# EAGLE design PulseFit (EAGLE 7.3.0)
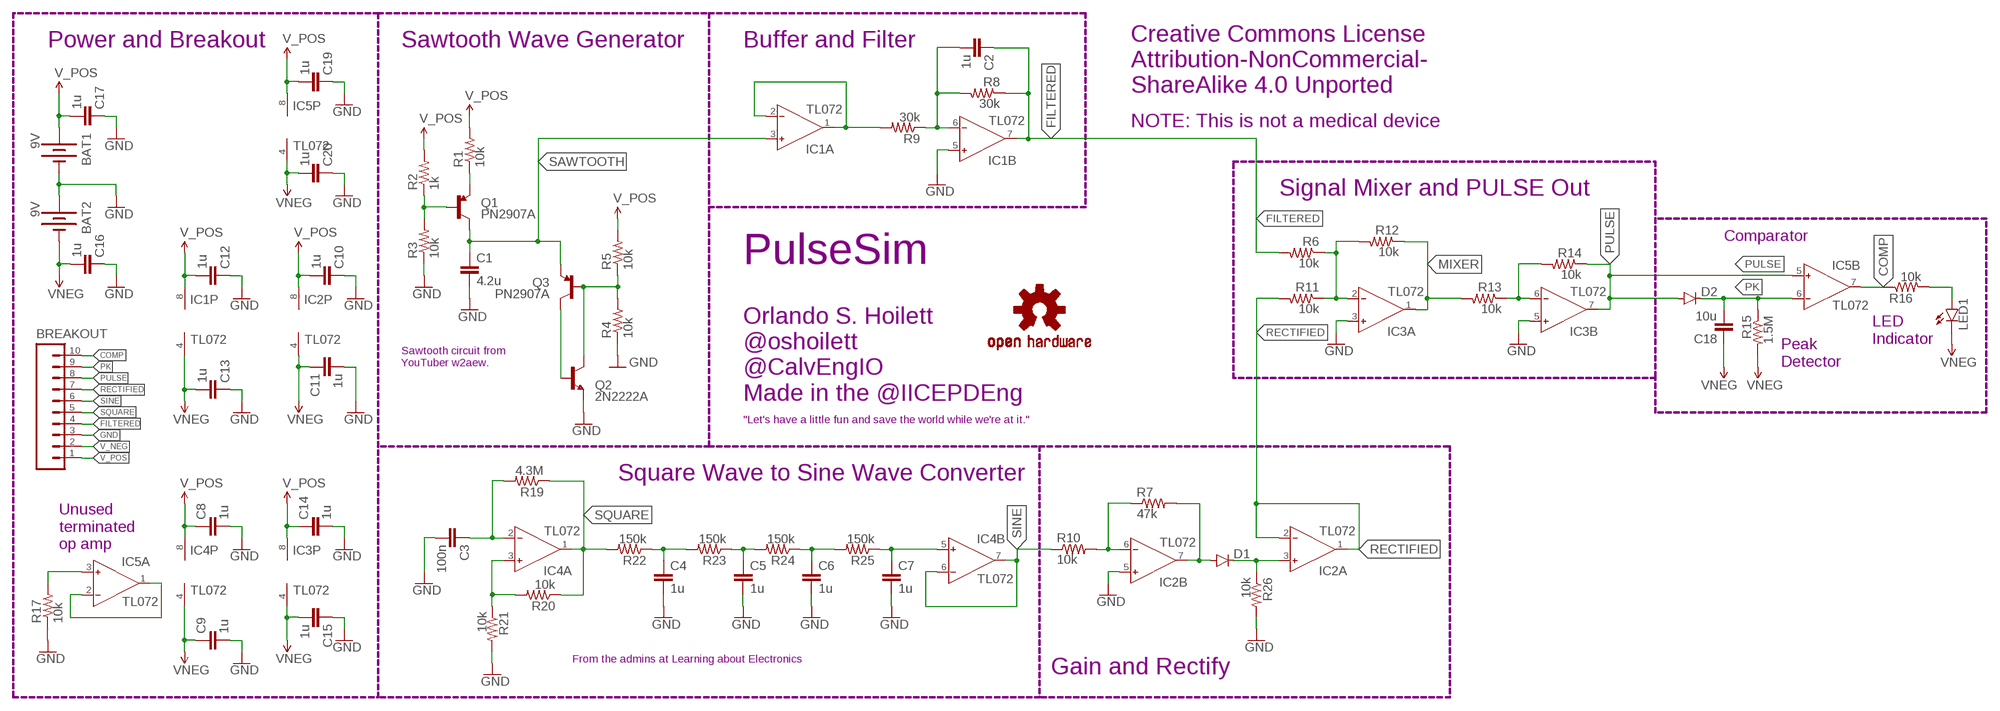
[diagram p0: schematic, sheet 1]

## Parts
BAT1  9V  BATTERY9V  [BATTCON_9V]
BAT2  9V  BATTERY9V  [BATTCON_9V]
BREAKOUT  M10NO_SILK_PTH_FEMALE  [1X10_NO_SILK]
C1  4.2u  C-EUC0402  [C0402]
C2  1u  C-EUC0402  [C0402]
C3  100n  C-EUC0402  [C0402]
C4  1u  C-EUC0402  [C0402]
C5  1u  C-EUC0402  [C0402]
C6  1u  C-EUC0402  [C0402]
C7  1u  C-EUC0402  [C0402]
C8  1u  C-EUC0402  [C0402]
C9  1u  C-EUC0402  [C0402]
C10  1u  C-EUC0402  [C0402]
C11  1u  C-EUC0402  [C0402]
C12  1u  C-EUC0402  [C0402]
C13  1u  C-EUC0402  [C0402]
C14  1u  C-EUC0402  [C0402]
C15  1u  C-EUC0402  [C0402]
C16  1u  C-EUC0402  [C0402]
C17  1u  C-EUC0402  [C0402]
C18  10u  C-EUC0402  [C0402]
C19  1u  C-EUC0402  [C0402]
C20  1u  C-EUC0402  [C0402]
D1  250mA/100V  DIODEBAS16  [SOD-323]
D2  250mA/100V  DIODEBAS16  [SOD-323]
IC1  TL072  AD8607R  [SO8]
IC2  TL072  AD8607R  [SO8]
IC3  TL072  AD8607R  [SO8]
IC4  TL072  AD8607R  [SO8]
IC5  TL072  AD8607R  [SO8]
LED1  LED1206-BOTTOM  [LED-1206-BOTTOM]
LOGO1  OSHW-LOGOS  [OSHW-LOGO-S]
Q1  PN2907A  TRANSISTOR_PNPMMBT4403  [SOT23-3]
Q2  2N2222A  TRANSISTOR_NPNMMBT5088  [SOT23-3]
Q3  PN2907A  TRANSISTOR_PNPMMBT4403  [SOT23-3]
R1  10k  R-US_R0402  [R0402]
R2  1k  R-US_R0402  [R0402]
R3  10k  R-US_R0402  [R0402]
R4  10k  R-US_R0402  [R0402]
R5  10k  R-US_R0402  [R0402]
R6  10k  R-US_R0402  [R0402]
R7  47k  R-US_R0402  [R0402]
R8  30k  R-US_R0402  [R0402]
R9  30k  R-US_R0402  [R0402]
R10  10k  R-US_R0402  [R0402]
R11  10k  R-US_R0402  [R0402]
R12  10k  R-US_R0402  [R0402]
R13  10k  R-US_R0402  [R0402]
R14  10k  R-US_R0402  [R0402]
R15  1.5M  R-US_R0402  [R0402]
R16  10k  R-US_R0402  [R0402]
R17  10k  R-US_R0402  [R0402]
R19  4.3M  R-US_R0402  [R0402]
R20  10k  R-US_R0402  [R0402]
R21  10k  R-US_R0402  [R0402]
R22  150k  R-US_R0402  [R0402]
R23  150k  R-US_R0402  [R0402]
R24  150k  R-US_R0402  [R0402]
R25  150k  R-US_R0402  [R0402]
R26  10k  R-US_R0402  [R0402]

## Nets
COMP: BREAKOUT.10 IC5.7(B:OUT) R16.1
FILTERED: BREAKOUT.4 C2.1 IC1.7(B:OUT) R6.2 R8.1
GND: BAT1.- BAT2.+ BREAKOUT.3 C1.2 C3.2 C4.2 C5.2 C6.2 C7.2 C8.2 C9.2 C10.1 C11.2 C12.1 C13.1 C14.2 C15.1 C16.1 C17.1 C19.1 C20.1 IC1.5(B:IN+) IC2.5(B:IN+) IC3.3(A:IN+) IC3.5(B:IN+) Q2.2(E) R3.1 R4.1 R17.1 R21.2 R26.2
MIXER: IC3.1(A:OUT) R12.1 R13.2
N$1: Q1.2(E) R1.1
N$2: IC3.6(B:IN-) R13.1 R14.2
N$3: Q1.1(B) R2.1 R3.2
N$4: Q2.3(C) Q3.1(B) R4.2 R5.1
N$5: Q2.1(B) Q3.3(C)
N$6: IC1.1(A:OUT) IC1.2(A:IN-) R9.2
N$8: IC3.2(A:IN-) R6.1 R11.1 R12.2
N$10: LED1.A R16.2
N$11: C2.2 IC1.6(B:IN-) R8.2 R9.1
N$12: IC5.1(A:OUT) IC5.2(A:IN-)
N$13: IC5.3(A:IN+) R17.2
N$17: C3.1 IC4.2(A:IN-) R19.2
N$18: IC4.3(A:IN+) R20.2 R21.1
N$19: C6.1 R24.1 R25.2
N$20: C4.1 R22.1 R23.2
N$21: C7.1 IC4.5(B:IN+) R25.1
N$22: C5.1 R23.1 R24.2
N$24: D1.C IC2.3(A:IN+) R26.1
N$25: IC2.6(B:IN-) R7.1 R10.2
N$27: D1.A IC2.7(B:OUT) R7.2
PK: BREAKOUT.9 C18.2 D2.C IC5.6(B:IN-) R15.1
PULSE: BREAKOUT.8 D2.A IC3.7(B:OUT) IC5.5(B:IN+) R14.1
RECTIFIED: BREAKOUT.7 IC2.1(A:OUT) IC2.2(A:IN-) R11.2
SAWTOOTH: C1.1 IC1.3(A:IN+) Q1.3(C) Q3.2(E)
SINE: BREAKOUT.6 IC4.6(B:IN-) IC4.7(B:OUT) R10.1
SQUARE: BREAKOUT.5 IC4.1(A:OUT) R19.1 R20.1 R22.2
V_BATT: BAT1.+ C8.1 C12.2 C14.1 C17.2 C19.2 IC1.8(P:V+) IC3.8(P:V+) IC4.8(P:V+) IC5.8(P:V+) ; supply symbol labelled V_POS
V_NEG: BREAKOUT.2 C9.1 C11.1 C13.2 C15.2 IC1.4(P:V-) IC2.4(P:V-) IC3.4(P:V-) IC4.4(P:V-) ; supply symbol labelled VNEG
V_POS: BREAKOUT.1 C10.2 IC2.8(P:V+) R1.2 R2.2 R5.2
VNEG: BAT2.- C16.2 C18.1 C20.2 IC5.4(P:V-) LED1.C R15.2

## Notes on the sheet
- Power and Breakout | Sawtooth Wave Generator | Buffer and Filter
- Creative Commons License
  Attribution-NonCommercial-
  ShareAlike 4.0 Unported
- NOTE: This is not a medical device
- Signal Mixer and PULSE Out
- Comparator
- PulseSim
- LED
  Indicator
- Sawtooth circuit from
  YouTuber w2aew.
- Peak
  Detector
- Orlando S. Hoilett
  @oshoilett
  @CalvEngIO
  Made in the @IICEPDEng
- "Let's have a little fun and save the world while we're at it."
- Square Wave to Sine Wave Converter
- Unused
  terminated
  op amp
- From the admins at Learning about Electronics
- Gain and Rectify

## Library data of the parts
BAT1 BAT2 = SparkFun-Electromechanical:BATTERY: Battery Holders Various common sizes : AA, AAA, 18650 (PRT-12895), 20mm coin cell and 12mm coin cell. 20MM_4LEGS, BATT-10373
BREAKOUT = SparkFun-Connectors:M10: Header 10 Standard 10-pin 0.1" header. Use with straight break away headers (SKU : PRT-00116), right angle break away headers (PRT-00553), swiss pins (PRT-00743), machine pins (PRT-00117), and female headers (PRT-00115).; PROD_ID: CONN-11563
C1-C20 = resistor:C-EU: CAPACITOR, European symbol
D1 D2 = SparkFun-DiscreteSemi:DIODE: Diode These are standard reverse protection diodes and small signal diodes. SMA package can handle up to about 1A. SOD-323 can handle about 200mA. What the SOD-323 package when ordering, there are some mfgs out there that are 5-pin packages.; PROD_ID: DIO-09646
IC1-IC5 = analog-devices:AD8607: Precision Micropower, Low Noise CMOS, Rail-to-Rail Input/Output Operational Amplifiers Source: http://www.analog.com/static/imported-files/data_sheets/AD8603_8607_8609.pdf; MPN: AD8607ARMZ-R2; OC_FARNELL: 1651293; OC_NEWARK: 19M8927
LED1 = SparkFun-LED:LED: LEDs Standard schematic elements and footprints for 5mm, 3mm, 1206, and 0603 sized LEDs. 5mm - Spark Fun Electronics SKU : COM-00529 (and others)
LOGO1 = SparkFun-Aesthetics:OSHW-LOGO: Open Source Hardware Logo This logo indicates the piece of hardware it is found on incorporates a OSHW license and/or adheres to the definition of open source hardware found here: http://freedomdefined.org/OSHW
Q1 Q3 = SparkFun-DiscreteSemi:TRANSISTOR_PNP: Generic PNP BJT Double check pinouts against datasheets- not all devices are the same! MMBT3906 - 40V 200mA SOT-23 (TRANS-08052) MMBT4403 - 40V 600mA SOT-23 (TRANS-09245); PROD_ID: TRANS-09245; VALUE: MMBT4403
Q2 = SparkFun-DiscreteSemi:TRANSISTOR_NPN: Generic NPN BJT MMBT2222A - TRANS-08049 (SOT-23, 1A 40V) MPSA42 - TRANS-09116 (SOT-23, 500mA 300V) MMBT5088LT1G - TRANS-11160 (SOT-23, 50 mA 30V) BC547 - COM-08928 <http://www.sparkfun.com/products/8928> (TO-92 45V 100mA) (1.Collector 2.Base 3.Emitter) 2N3904 - COM-00521 <http://www.sparkfun.com/products/521> (TO-92 40V 200mA) (1.Emitter 2.Base 3.Collector) P2N2222A - COM-12852 <http://www.sparkfun.com/products/12852> (TO-92 40V 600mA) (1.Collector 2.Base 3.Emitter); PROD_ID: TRANS-11160; VALUE: MMBT5088
R1-R17 R19-R26 = resistor:R-US_: RESISTOR, American symbol

## Board
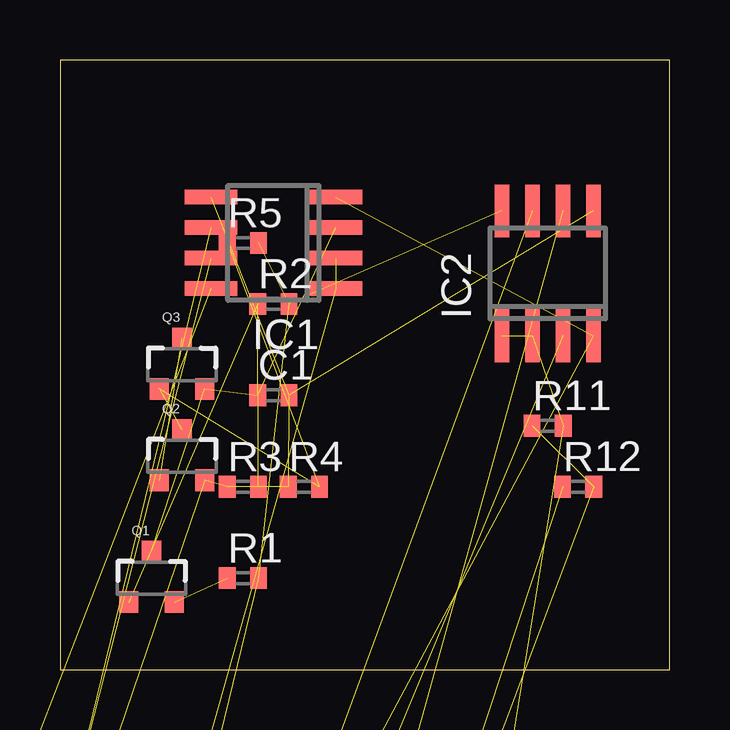
[diagram p1: board, top side]
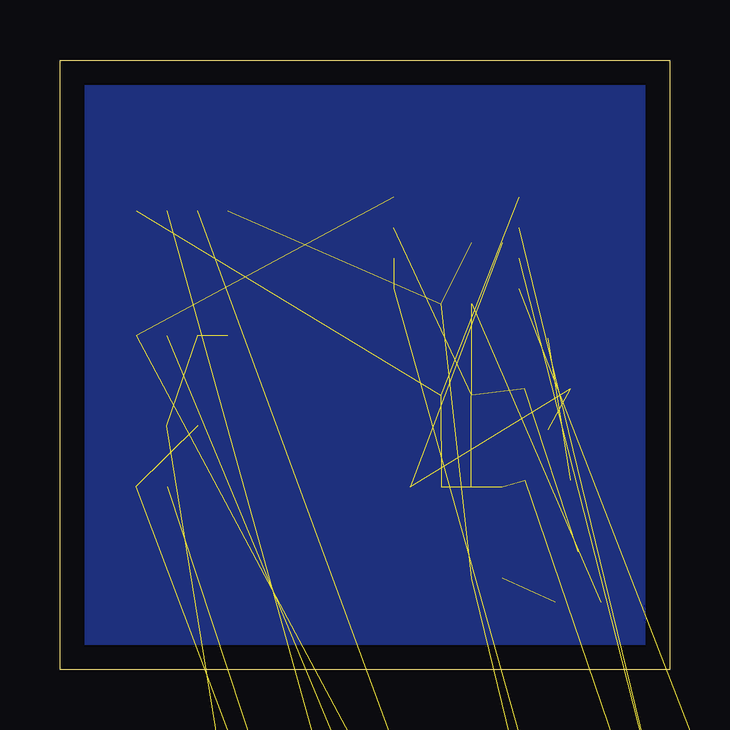
[diagram p2: board, bottom side, seen from below]

Size 25.4 x 25.4 mm. Coordinates in mm from the lower left corner, seen from the top.
Outline: 0,0 25.4,0 25.4,25.4 0,25.4 0,0
Copper layers (1*16): Top 0.035mm / dielectric 1.5mm / Bottom 0.035mm
Design rules "default": minimum track width 10mil, minimum drill 24mil, track to track 8mil, track to pad 8mil, pad to pad 8mil, via to via 8mil, smd to smd 8mil, copper to edge 40mil, drill to drill 8mil, minimum pad ring 10mil, minimum via ring 8mil, stop-mask expansion 4mil, vias tented up to drill 0mil, thermal gap 10mil

### Footprints (pad centres in the part's own frame; a part is rotated, then mirrored left to right if it is on the bottom)
BATTCON_9V = drill 1.905: + 0,0; - 0,-12.954
1X10_NO_SILK = drill 1.016 pad 1.88: 1 0,0; 2 2.54,0; 3 5.08,0; 4 7.62,0; 5 10.16,0; 6 12.7,0; 7 15.24,0; 8 17.78,0; 9 20.32,0; 10 22.86,0
C0402 = smd 0.7 x 0.9: 1 -0.65,0; 2 0.65,0
SOD-323 = smd 0.63 x 0.83: A 1.15,0; C -1.15,0
SO8 = smd 0.6 x 2.2: 1 -1.905,-2.6; 2 -0.635,-2.6; 3 0.635,-2.6; 4 1.905,-2.6; 5 1.905,2.6; 6 0.635,2.6; 7 -0.635,2.6; 8 -1.905,2.6
LED-1206-BOTTOM = smd 1.5 x 1.6: A -1.8,0; C 1.8,0 | hole 2.3: 0,0
SOT23-3 = smd 0.8 x 0.9: 1 -0.95,-1; 2 0.95,-1; 3 0,1.1
R0402 = smd 0.7 x 0.9: 1 -0.65,0; 2 0.65,0

### Placement (x,y rotation side)
BAT1  18.59,-178.46 0 top  (outside the outline)
BAT2  18.59,-208.64 0 top  (outside the outline)
BREAKOUT  -43.38,-293.12 0 top  (outside the outline)
C1  8.89,11.43 0 top
C2  -25.4,-116.84 0 top  (outside the outline)
C3  -21.59,-74.93 0 top  (outside the outline)
C4  -21.59,-82.55 0 top  (outside the outline)
C5  -21.59,-90.17 0 top  (outside the outline)
C6  -21.59,-101.6 0 top  (outside the outline)
C7  -17.78,-101.6 0 top  (outside the outline)
C8  -25.4,-124.46 0 top  (outside the outline)
C9  -25.4,-128.27 0 top  (outside the outline)
C10  -25.4,-132.08 0 top  (outside the outline)
C11  -25.4,-135.89 0 top  (outside the outline)
C12  -25.4,-139.7 0 top  (outside the outline)
C13  -25.4,-143.51 0 top  (outside the outline)
C14  -33.32,-157.84 0 top  (outside the outline)
C15  -33.32,-162.61 0 top  (outside the outline)
C16  -33.32,-232.51 0 top  (outside the outline)
C17  -33.32,-237.29 0 top  (outside the outline)
C18  -44.09,-256.39 0 top  (outside the outline)
C19  -44.09,-282.4 0 top  (outside the outline)
C20  -44.09,-287.17 0 top  (outside the outline)
D1  -25.4,-100.33 0 top  (outside the outline)
D2  -43.69,-247.35 0 top  (outside the outline)
IC1  8.89,17.78 90 top
IC2  20.32,16.51 0 top
IC3  -30.78,-152.45 0 top  (outside the outline)
IC4  -19.05,-57.15 0 top  (outside the outline)
IC5  -40.39,-271.48 0 top  (outside the outline)
LED1  -42.57,-264.82 0 top  (outside the outline)
LOGO1  -25.4,-147.52 0 top  (outside the outline)
Q1  3.81,3.81 0 top
Q2  5.08,8.89 0 top
Q3  5.08,12.7 0 top
R1  7.62,3.81 0 top
R2  8.89,15.24 0 top
R3  7.62,7.62 0 top
R4  10.16,7.62 0 top
R5  7.62,17.78 0 top
R6  -25.4,-120.65 0 top  (outside the outline)
R7  -25.81,-151.13 0 top  (outside the outline)
R8  -25.4,-109.22 0 top  (outside the outline)
R9  -25.4,-113.03 0 top  (outside the outline)
R10  -25.81,-154.48 0 top  (outside the outline)
R11  20.32,10.16 0 top
R12  21.59,7.62 0 top
R13  -33.32,-242.06 0 top  (outside the outline)
R14  -33.32,-246.84 0 top  (outside the outline)
R15  -44.09,-251.61 0 top  (outside the outline)
R16  -44.09,-261.16 0 top  (outside the outline)
R17  -44.09,-277.62 0 top  (outside the outline)
R19  -21.59,-63.5 0 top  (outside the outline)
R20  -21.59,-67.31 0 top  (outside the outline)
R21  -21.59,-71.12 0 top  (outside the outline)
R22  -21.59,-78.74 0 top  (outside the outline)
R23  -21.59,-86.36 0 top  (outside the outline)
R24  -21.59,-93.98 0 top  (outside the outline)
R25  -21.59,-97.79 0 top  (outside the outline)
R26  -25.4,-105.41 0 top  (outside the outline)

### Tracks (layer width: path | path; a pad name or v marks a point on that pad's centre or on a via)
COMP  (2 unrouted)
FILTERED  (4 unrouted)
GND  (30 unrouted)
  pour Bottom (isolate 0.203): 0,25.4 25.4,25.4 25.4,0 0,0
MIXER  (2 unrouted)
N$1  (1 unrouted)
N$2  (2 unrouted)
N$3  (2 unrouted)
N$4  (3 unrouted)
N$5  (1 unrouted)
N$6  (2 unrouted)
N$8  (3 unrouted)
N$10  (1 unrouted)
N$11  (3 unrouted)
N$12  (1 unrouted)
N$13  (1 unrouted)
N$17  (2 unrouted)
N$18  (2 unrouted)
N$19  (2 unrouted)
N$20  (2 unrouted)
N$21  (2 unrouted)
N$22  (2 unrouted)
N$24  (2 unrouted)
N$25  (2 unrouted)
N$27  (2 unrouted)
PK  (4 unrouted)
PULSE  (4 unrouted)
RECTIFIED  (3 unrouted)
SAWTOOTH  (3 unrouted)
SINE  (3 unrouted)
SQUARE  (4 unrouted)
V_BATT  (9 unrouted)
V_NEG  (8 unrouted)
V_POS  (5 unrouted)
VNEG  (6 unrouted)